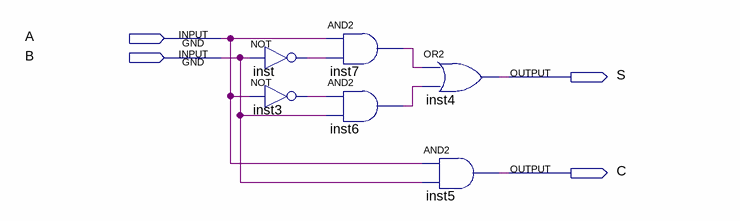
[diagram p0: schematic sheet]
// Quartus schematic 1-Half-Adder.bdf as structural Verilog: 6 symbols, 4 pins
module \1-Half-Adder  (
  input  A,
  input  B,
  output S,
  output C
);

  wire inst3_out, inst6_out, inst7_out, inst_out;

  not inst (inst_out, B);
  not inst3 (inst3_out, A);
  and inst7 (inst7_out, A, inst_out);
  and inst6 (inst6_out, inst3_out, B);
  or inst4 (S, inst7_out, inst6_out);
  and inst5 (C, A, B);
endmodule
